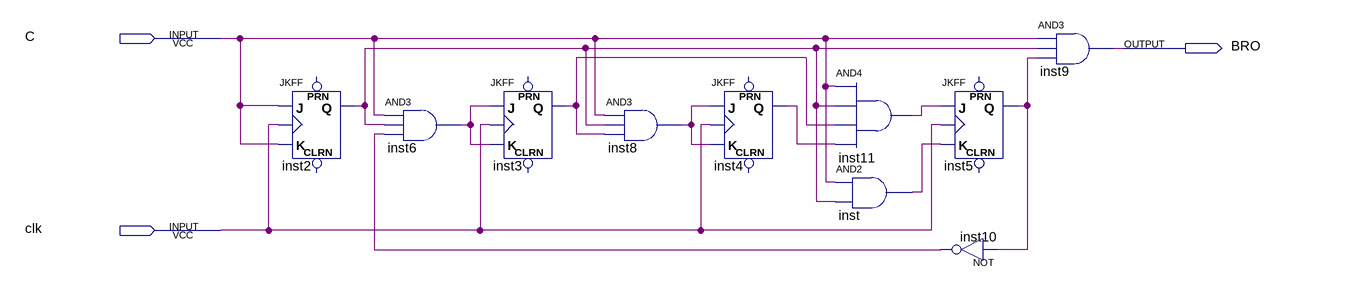
[diagram p0: schematic sheet]
// Quartus schematic BCD_counter.bdf as structural Verilog: 10 symbols, 3 pins
module BCD_counter (
  input  C,
  input  clk,
  output BRO
);

  wire inst2_q, inst3_q, inst4_q, inst5_q, inst6_out, inst8_out, inst10_out, inst11_out, inst_out;

  JKFF inst2 (.K(C), .J(C), .CLK(clk), .Q(inst2_q));  // open: PRN, CLRN
  and inst6 (inst6_out, C, inst2_q, inst10_out);
  JKFF inst3 (.K(inst6_out), .J(inst6_out), .CLK(clk), .Q(inst3_q));  // open: PRN, CLRN
  and inst8 (inst8_out, C, inst2_q, inst3_q);
  JKFF inst4 (.K(inst8_out), .J(inst8_out), .CLK(clk), .Q(inst4_q));  // open: PRN, CLRN
  and inst11 (inst11_out, C, inst2_q, inst3_q, inst4_q);
  and inst (inst_out, C, inst2_q);
  JKFF inst5 (.K(inst_out), .J(inst11_out), .CLK(clk), .Q(inst5_q));  // open: PRN, CLRN
  not inst10 (inst10_out, inst5_q);
  and inst9 (BRO, C, inst2_q, inst5_q);
endmodule
